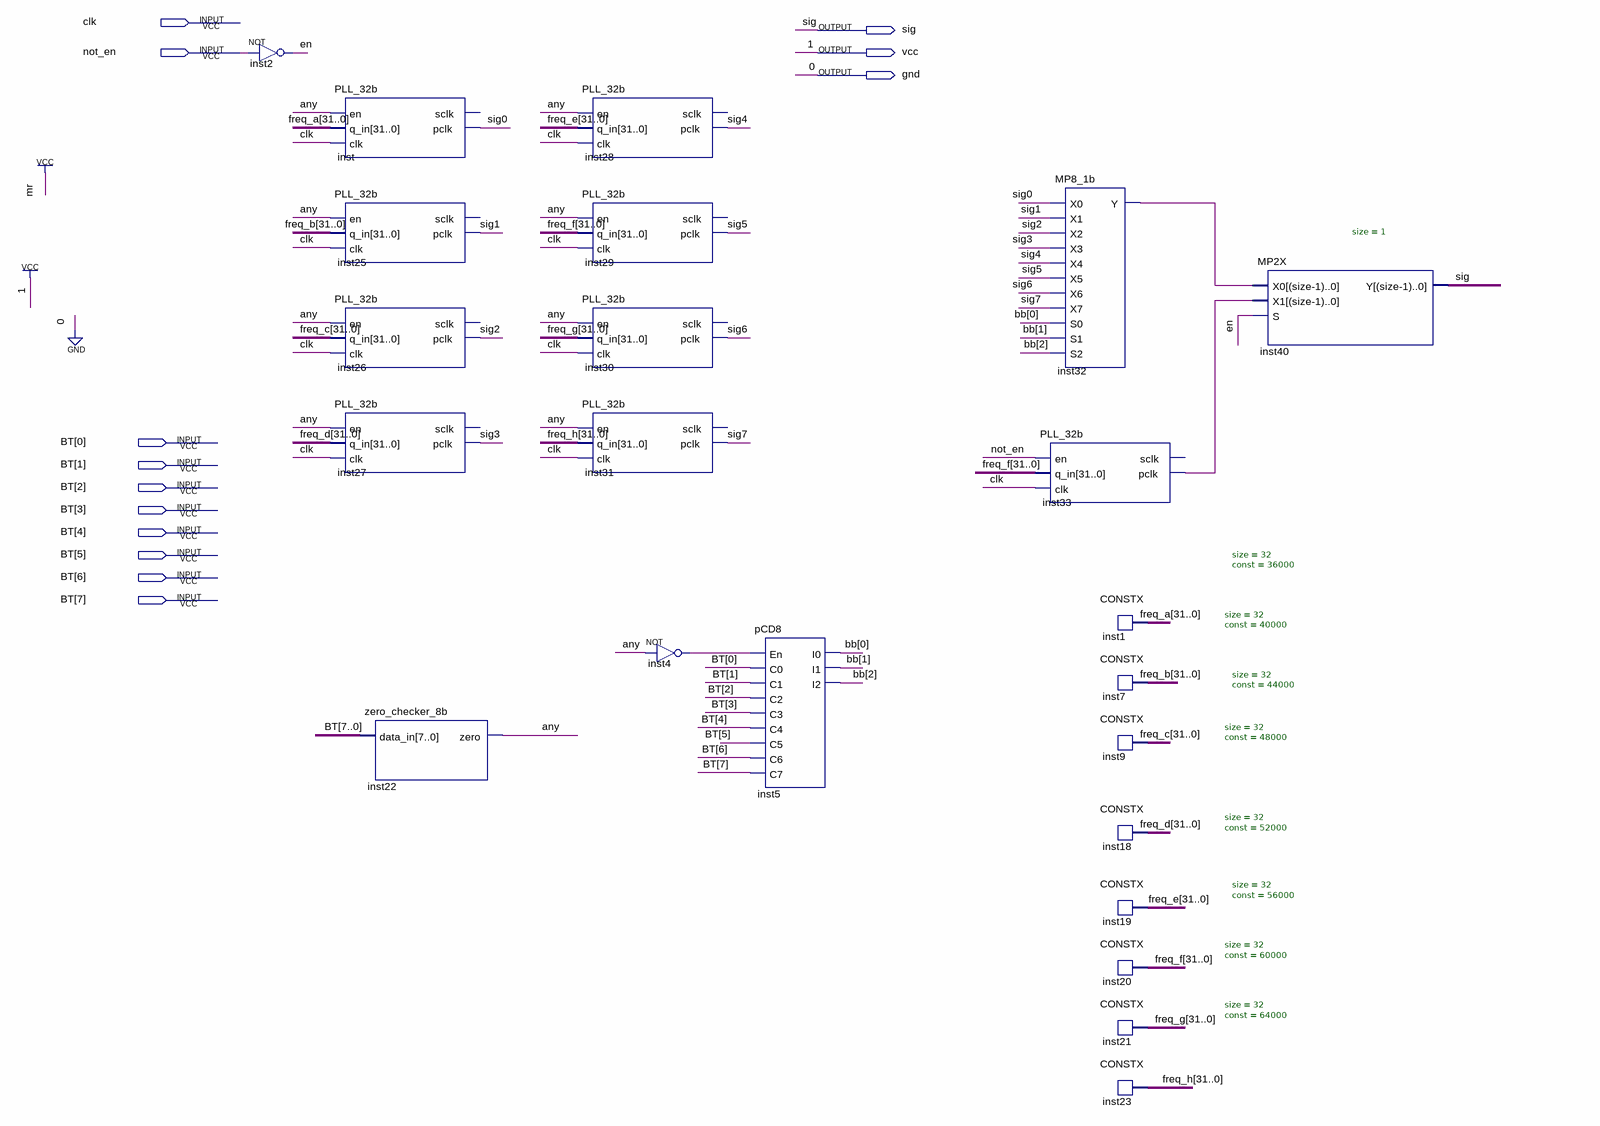
[diagram p0: schematic sheet]
// Quartus schematic BuzzerController.bdf as structural Verilog: 23 symbols, 13 pins
module BuzzerController (
  input  clk,
  input  not_en,
  input  [7:0] BT,
  output sig,
  output vcc,
  output gnd
);

  wire any, en, inst4_out, inst32_y, inst33_pclk, sig0, sig1, sig2, sig3, sig4, sig5, sig6, sig7;
  wire [2:0] bb;
  wire [31:0] freq_a, freq_b, freq_c, freq_d, freq_e, freq_f, freq_g, freq_h;

  not inst2 (en, not_en);
  PLL_32b inst (.en(any), .q_in(freq_a), .clk(clk), .pclk(sig0));  // open: sclk
  PLL_32b inst25 (.en(any), .q_in(freq_b), .clk(clk), .pclk(sig1));  // open: sclk
  PLL_32b inst26 (.en(any), .q_in(freq_c), .clk(clk), .pclk(sig2));  // open: sclk
  PLL_32b inst27 (.en(any), .q_in(freq_d), .clk(clk), .pclk(sig3));  // open: sclk
  zero_checker_8b inst22 (.data_in(BT), .zero(any));
  PLL_32b inst28 (.en(any), .q_in(freq_e), .clk(clk), .pclk(sig4));  // open: sclk
  PLL_32b inst29 (.en(any), .q_in(freq_f), .clk(clk), .pclk(sig5));  // open: sclk
  PLL_32b inst30 (.en(any), .q_in(freq_g), .clk(clk), .pclk(sig6));  // open: sclk
  PLL_32b inst31 (.en(any), .q_in(freq_h), .clk(clk), .pclk(sig7));  // open: sclk
  not inst4 (inst4_out, any);
  pCD8 inst5 (
    .En(inst4_out), .C0(BT[0]), .C1(BT[1]), .C2(BT[2]), .C3(BT[3]), .C4(BT[4]), .C5(BT[5]), .C6(BT[6]),
    .C7(BT[7]), .I0(bb[0]), .I1(bb[1]), .I2(bb[2]));
  MP8_1b inst32 (
    .X0(sig0), .X1(sig1), .X2(sig2), .X3(sig3), .X4(sig4), .X5(sig5), .X6(sig6), .X7(sig7), .S0(bb[0]),
    .S1(bb[1]), .S2(bb[2]), .Y(inst32_y));
  PLL_32b inst33 (.en(not_en), .q_in(freq_f), .clk(clk), .pclk(inst33_pclk));  // open: sclk
  CONSTX #(.size(32), .\const (36000)) inst1 (.data(freq_a));
  CONSTX #(.size(32), .\const (40000)) inst7 (.data(freq_b));
  CONSTX #(.size(32), .\const (44000)) inst9 (.data(freq_c));
  CONSTX #(.size(32), .\const (48000)) inst18 (.data(freq_d));
  CONSTX #(.size(32), .\const (52000)) inst19 (.data(freq_e));
  CONSTX #(.size(32), .\const (56000)) inst20 (.data(freq_f));
  CONSTX #(.size(32), .\const (60000)) inst21 (.data(freq_g));
  CONSTX #(.size(32), .\const (64000)) inst23 (.data(freq_h));
  MP2X #(.size(1)) inst40 (.X0(inst32_y), .X1(inst33_pclk), .S(en), .Y(sig));

  assign gnd = 1'b0;
  assign vcc = 1'b1;
endmodule
